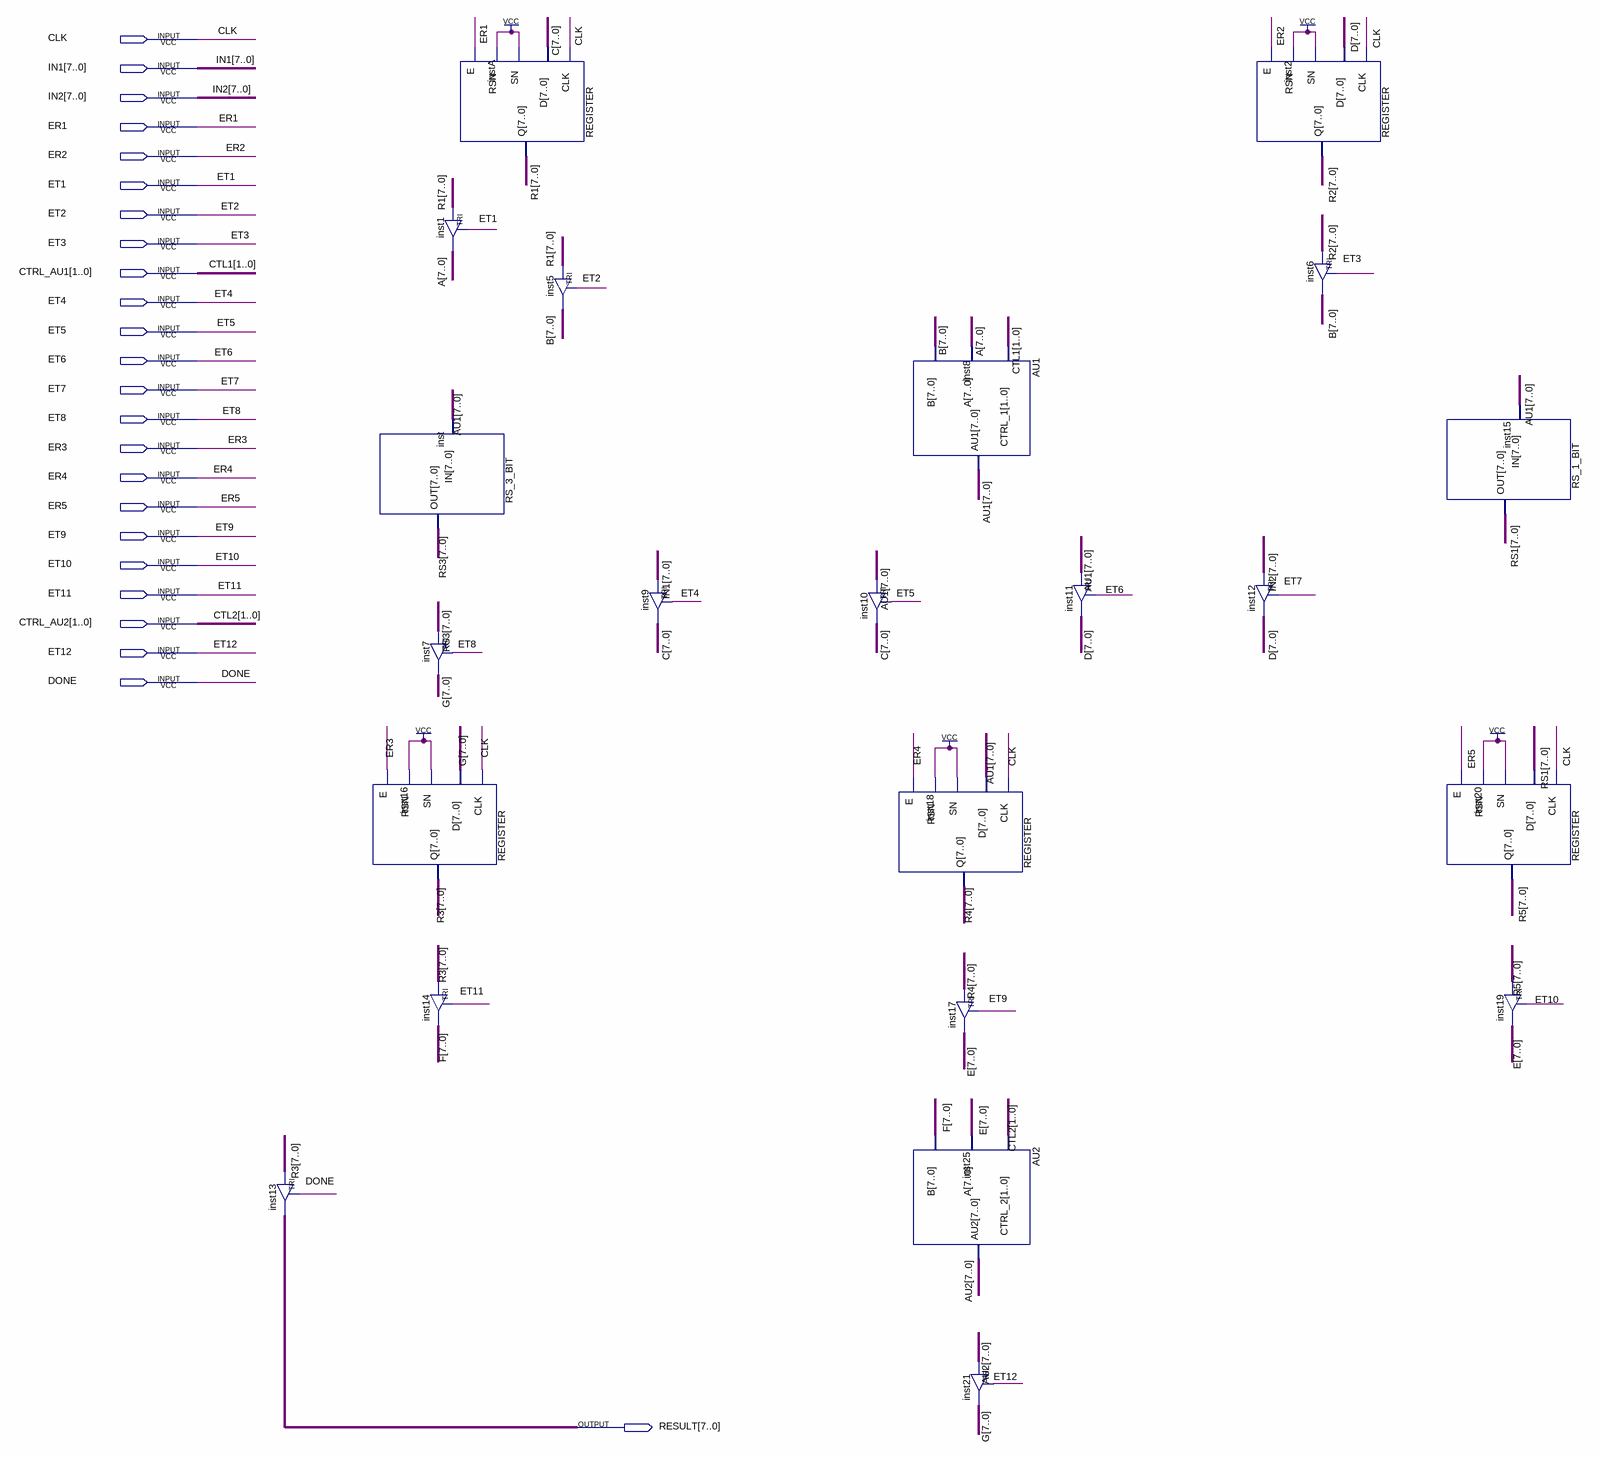
[diagram p0: schematic sheet]
// Quartus schematic Piplined_Datapath_DATAPATH.bdf as structural Verilog: 22 symbols, 24 pins
module Piplined_Datapath_DATAPATH (
  input  CLK,
  input  [7:0] IN1,
  input  [7:0] IN2,
  input  ER1,
  input  ER2,
  input  ET1,
  input  ET2,
  input  ET3,
  input  [1:0] CTRL_AU1,
  input  ET4,
  input  ET5,
  input  ET6,
  input  ET7,
  input  ET8,
  input  ER3,
  input  ER4,
  input  ER5,
  input  ET9,
  input  ET10,
  input  ET11,
  input  [1:0] CTRL_AU2,
  input  ET12,
  input  DONE,
  output [7:0] RESULT
);

  wire [7:0] A, AU1, AU2, B, C, D, E, F, G, R1, R2, R3, R4, R5, RS1, RS3;

  TRI inst13[7:0] (.IN(R3), .OE(DONE), .OUT(RESULT));
  RS_3_BIT inst (.IN(AU1), .OUT(RS3));
  REGISTER inst16 (.CLK(CLK), .D(G), .SN(1'b1), .RSN(1'b1), .E(ER3), .Q(R3));
  REGISTER instA (.CLK(CLK), .D(C), .SN(1'b1), .RSN(1'b1), .E(ER1), .Q(R1));
  TRI inst1[7:0] (.IN(R1), .OE(ET1), .OUT(A));
  TRI inst7[7:0] (.IN(RS3), .OE(ET8), .OUT(G));
  TRI inst14[7:0] (.IN(R3), .OE(ET11), .OUT(F));
  TRI inst5[7:0] (.IN(R1), .OE(ET2), .OUT(B));
  TRI inst9[7:0] (.IN(IN1), .OE(ET4), .OUT(C));
  AU1 inst8 (.CTRL_1(CTRL_AU1), .A(A), .B(B), .AU1(AU1));
  TRI inst10[7:0] (.IN(AU1), .OE(ET5), .OUT(C));
  REGISTER inst18 (.CLK(CLK), .D(AU1), .SN(1'b1), .RSN(1'b1), .E(ER4), .Q(R4));
  AU2 inst25 (.CTRL_2(CTRL_AU2), .A(E), .B(F), .AU2(AU2));
  TRI inst17[7:0] (.IN(R4), .OE(ET9), .OUT(E));
  TRI inst21[7:0] (.IN(AU2), .OE(ET12), .OUT(G));
  TRI inst11[7:0] (.IN(AU1), .OE(ET6), .OUT(D));
  REGISTER inst2 (.CLK(CLK), .D(D), .SN(1'b1), .RSN(1'b1), .E(ER2), .Q(R2));
  TRI inst12[7:0] (.IN(IN2), .OE(ET7), .OUT(D));
  TRI inst6[7:0] (.IN(R2), .OE(ET3), .OUT(B));
  RS_1_BIT inst15 (.IN(AU1), .OUT(RS1));
  REGISTER inst20 (.CLK(CLK), .D(RS1), .SN(1'b1), .RSN(1'b1), .E(ER5), .Q(R5));
  TRI inst19[7:0] (.IN(R5), .OE(ET10), .OUT(E));

  // Other names for the same wires on the sheet: CTL1[1:0] = CTRL_AU1; CTL2[1:0] = CTRL_AU2
endmodule
